# Altium schematic sheet Port Def.schdoc
size 215 x 139 mm
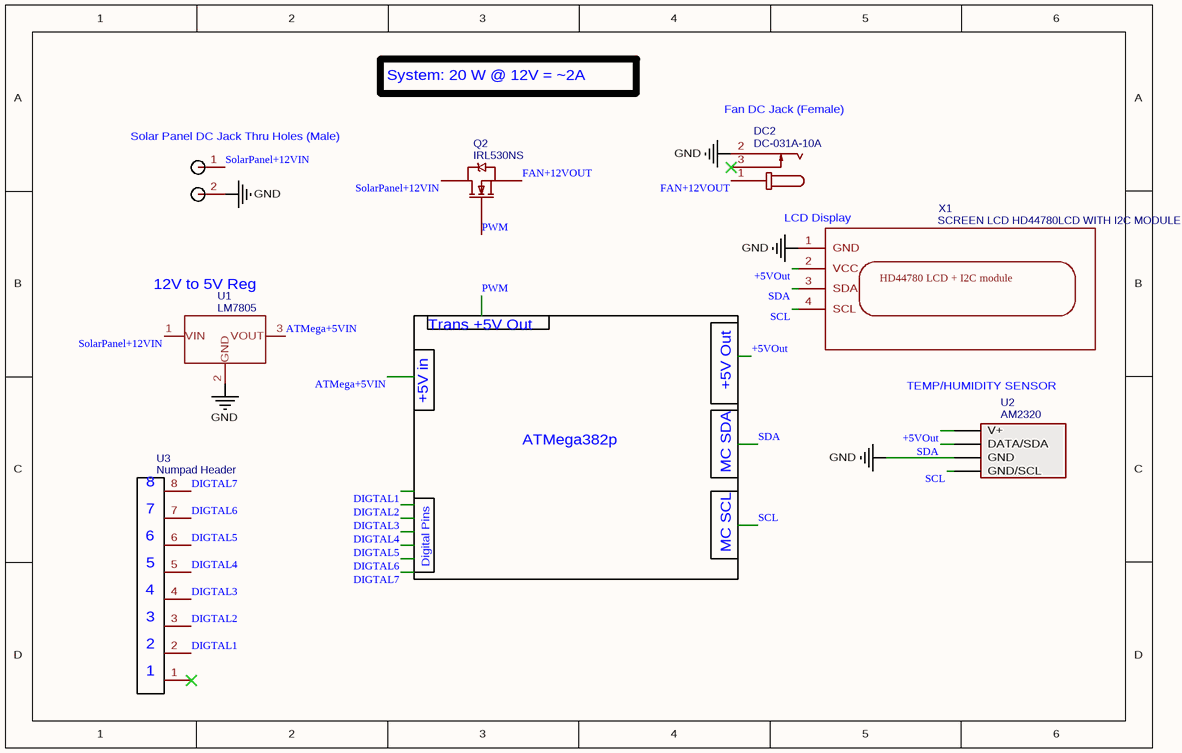
[diagram p0: Port Def.schdoc]

## Parts
DC2  DC-031A-10A  [DC-IN-SMD_DC-031A-10A]
Q2  IRL530NS  [D2PAK]
U1  LM7805  [SEEED-TO-220]
U2  AM2320  [AM2320]
U3  Numpad Header  [PINHEADER-8PIN]
X1  SCREEN LCD HD44780LCD WITH I2C MODULE  [LCD HD44780LCD WITH I2C MODULE]
XT1  Pad  [THROUGH HOLE PAD 1.5MM HOLE 3.0MM PAD]  (value not drawn)
XT2  Pad  [THROUGH HOLE PAD 1.5MM HOLE 3.0MM PAD]  (value not drawn)

## Nets
GND: DC2.2 U1.2(GND) U2.3(GND) X1.1(GND) XT2.2(TH_Pad)
+5VOut: U2.1(V+) X1.2(VCC)
ATMega+5VIN: U1.3(VOUT)
FAN+12VOUT: DC2.1 Q2.3(S)
PWM: Q2.1(G)
SCL: U2.4(GND/SCL) X1.4(SCL)
SDA: U2.2(DATA/SDA) X1.3(SDA)
SolarPanel+12VIN: Q2.2(D) U1.1(VIN) XT1.1(TH_Pad)

Not connected (* = marked no-connect by the designer): DC2 3*; U3 1 2 3 4 5 6 7 8

## Notes on the sheet
- System: 20 W @ 12V = ~2A
- (near XT1) Solar Panel DC Jack Thru Holes (Male)
- (near DC2) Fan DC Jack (Female)
- (near X1) LCD Display
- (near U1) 12V to 5V Reg
- Trans +5V Out
- +5V Out
- +5V in
- MC SDA
- (near U2) TEMP/HUMIDITY SENSOR
- Digital Pins
- ATMega382p
- MC SCL
- Labels drawn without touching a wire or pin: DIGTAL1, DIGTAL2, DIGTAL3, DIGTAL4, DIGTAL5, DIGTAL6, DIGTAL7
- (in symbol SCREEN LCD HD44780LCD WITH I2C MODULE) HD44780 LCD + I2C module

## Library data of the parts
DC2 = DC-031A-10A: BOM_Manufacturer: HRO; Contributor: LCSC; BOM_Supplier: LCSC; BOM_Manufacturer Part: DC-031A-10A; BOM_Supplier Part: C145927; spicePre: D; spiceSymbolName: DC-031A-10A
Q2 = IRL530NS: description: HEXFET Power MOSFET; spicePre: Q; spiceSymbolName: IRL530NS
U1 = LM7805: BOM_Manufacturer Part: LM7805ACT; description: DIP PMIC;LDO;Vin 7.5-20V;Adj;1A;Without En;1-Ch; sourceId: nNHZTbsmE; timeStamp: 1448003326; BOM_Supplier Part: 310030049; BOM_Supplier: SeeedStudio; spicePre: U; spiceSymbolName: LM7805ACT
U2 = AM2320: BOM_Manufacturer: EasyEDA; BOM_Manufacturer Part: Header-Male-2.54_1x4; BOM_EasyEDA: E59481; BOM_Supplier Part: E59481; BOM_Supplier: EasyEDA; spicePre: U; spiceSymbolName: AM2320
U3 = Numpad Header: Contributor: iammuria; spicePre: U; spiceSymbolName: PIN HEADER 8 PIN
X1 = SCREEN LCD HD44780LCD WITH I2C MODULE: Contributor: dartagnan586e; spicePre: X; spiceSymbolName: SCREEN LCD HD44780LCD WITH I2C MODULE
XT1 XT2 = Pad: Contributor: Artem_Kosorukov; spicePre: X; spiceSymbolName: Pad